# Altium schematic sheet PPU2 And Connector.SchDoc: SNES TST
size A4; DrawnBy: Opatus; DocumentNumber: 2; Revision: 0; SheetNumber: 2; SheetTotal: 4
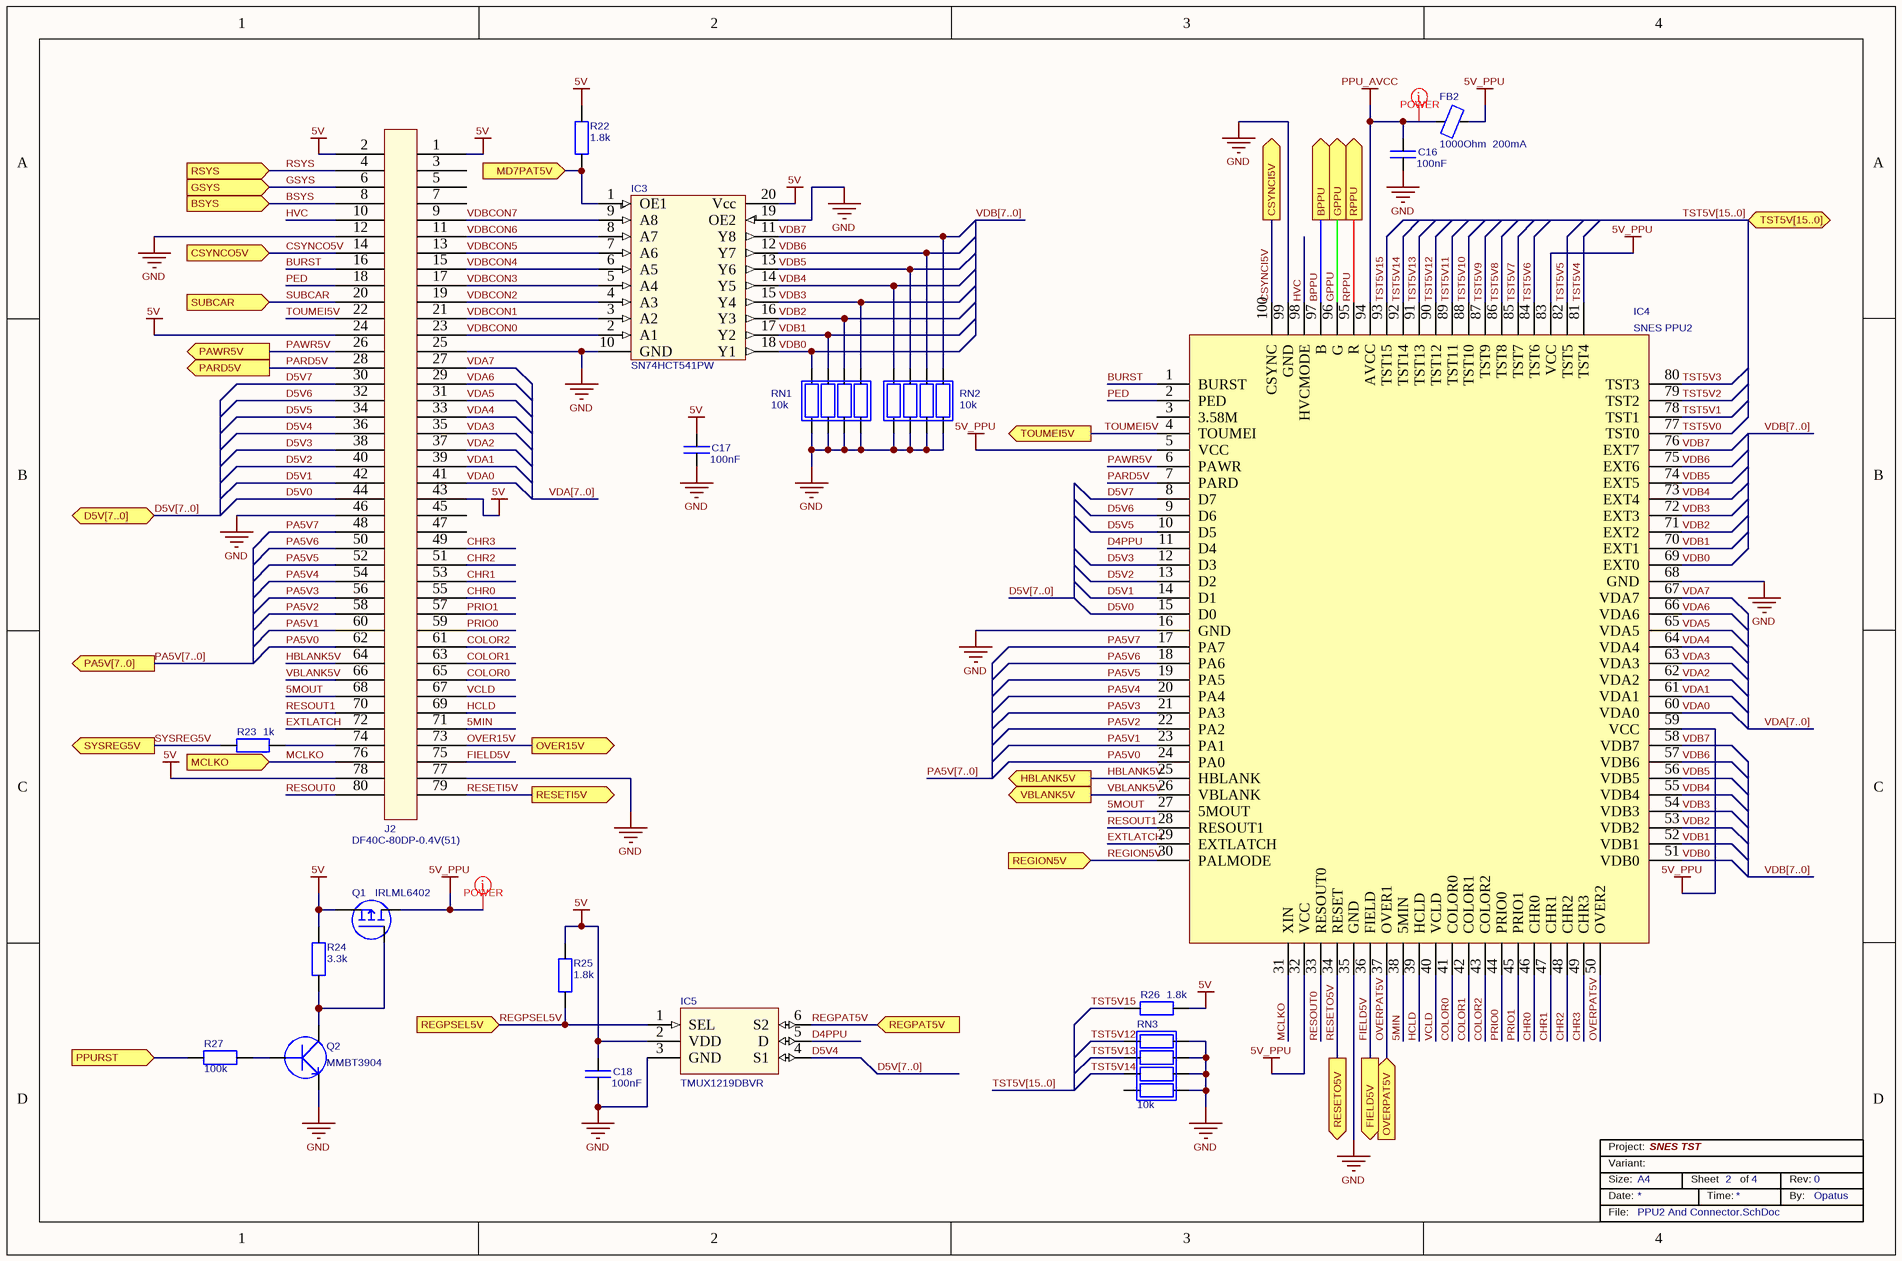
[diagram p0: PPU2 And Connector.SchDoc]

## Parts
C16  value 100nF  [Cap_0402_Chip]  (hidden comment: Ceramic Capacitor 100nF 10V ±20% X7R 0402)
C17  value 100nF  [Cap_0402_Chip]  (hidden comment: Ceramic Capacitor 100nF 10V ±20% X7R 0402)
C18  value 100nF  [Cap_0402_Chip]  (hidden comment: Ceramic Capacitor 100nF 10V ±20% X7R 0402)
FB2  1000Ohm  200mA  [Ind_0402_Chip]
IC3  Manufacturer_Part_Number: SN74HCT541PW  [TSSOP20 Narrow]  (hidden comment: SN74HCT541)
IC4  SNES PPU2  [PPU100Pin]  (no BOM)
IC5  Manufacturer_Part_Number: TMUX1219DBVR  [SOT23-6]  (hidden comment: TMUX1219)
J2  Manufacturer_Part_Number: DF40C-80DP-0.4V(51)  [DF40C-80DP]  (hidden comment: DF40C-80DP)
Q1  IRLML6402  [SOT23_FET]
Q2  MMBT3904  [SOT23_Transistor]
R22  value 1.8k  [Res_0402_Chip]  (hidden comment: Resistor 1.8k 0402 ±1%)
R23  value 1k  [Res_0402_Chip]  (hidden comment: Resistor 1k 0402 ±1%)
R24  value 3.3k  [Res_0402_Chip]  (hidden comment: Resistor 3.3k 0402 ±1%)
R25  value 1.8k  [Res_0402_Chip]  (hidden comment: Resistor 1.8k 0402 ±1%)
R26  value 1.8k  [Res_0402_Chip]  (hidden comment: Resistor 1.8k 0402 ±1%)
R27  value 100k  [Res_0402_Chip]  (hidden comment: Resistor 100k 0402 ±1%)
RN1  value 10k  [1206_Array_Chip]  (hidden comment: Resistor Network 10k 1206 ±1%)
RN2  value 10k  [1206_Array_Chip]  (hidden comment: Resistor Network 10k 1206 ±1%)
RN3  value 10k  [1206_Array_Chip]  (hidden comment: Resistor Network 10k 1206 ±1%)

## Ports
BPPU (out), BSYS (in), CSYNCI5V (out), CSYNCO5V (in), D5V[7..0] (bidir), FIELD5V (out), GPPU (out), GSYS (in), HBLANK5V (out), MCLKO (in), MD7PAT5V (in), OVER15V (out), OVERPAT5V (in), PA5V[7..0] (out), PARD5V (out), PAWR5V (out), PPURST (in), REGION5V (in), REGPAT5V (in), REGPSEL5V (in), RESETI5V (out), RESETO5V (out), RPPU (out), RSYS (in), SUBCAR (in), SYSREG5V (out), TOUMEI5V (out), TST5V[15..0] (bidir), VBLANK5V (out)

## Nets
5V: C17.1 C18.1 IC3.20(Vcc) IC5.2(VDD) J2.1 J2.2 J2.24 J2.43 J2.78 Q1.S R22.1 R24.1 R25.1 R26.1
5V_PPU: FB2.1 IC4.5(VCC) IC4.32(VCC) IC4.59(VCC) IC4.83(VCC) Q1.D
GND: C16.2 C17.2 C18.2 IC3.10(GND) IC3.19(OE2) IC4.16(GND) IC4.35(GND) IC4.68(GND) IC4.99(GND) IC5.3(GND) J2.12 J2.25 J2.46 J2.77 Q2.E RN1.1 RN1.2 RN1.3 RN1.4 RN2.1 RN2.2 RN2.3 RN2.4 RN3.1 RN3.2 RN3.3 RN3.4
PPU_AVCC: C16.1 FB2.2 IC4.94(AVCC)
5MIN: IC4.38(5MIN) J2.71
5MOUT: IC4.27(5MOUT) J2.68
BPPU: IC4.97(B) ; port BPPU
BSYS: J2.8 ; port BSYS
BURST: IC4.1(BURST) J2.16
CHR0: IC4.46(CHR0) J2.55
CHR1: IC4.47(CHR1) J2.53
CHR2: IC4.48(CHR2) J2.51
CHR3: IC4.49(CHR3) J2.49
COLOR0: IC4.41(COLOR0) J2.65
COLOR1: IC4.42(COLOR1) J2.63
COLOR2: IC4.43(COLOR2) J2.61
CSYNCI5V: IC4.100(CSYNC) ; port CSYNCI5V
CSYNCO5V: J2.14 ; port CSYNCO5V
D4PPU: IC4.11(D4) IC5.5(D)
D5V0: IC4.15(D0) J2.44
D5V1: IC4.14(D1) J2.42
D5V2: IC4.13(D2) J2.40
D5V3: IC4.12(D3) J2.38
D5V4: IC5.4(S1) J2.36
D5V5: IC4.10(D5) J2.34
D5V6: IC4.9(D6) J2.32
D5V7: IC4.8(D7) J2.30
EXTLATCH: IC4.29(EXTLATCH) J2.72
FIELD5V: IC4.36(FIELD) J2.75 ; port FIELD5V
GPPU: IC4.96(G) ; port GPPU
GSYS: J2.6 ; port GSYS
HBLANK5V: IC4.25(HBLANK) J2.64 ; port HBLANK5V
HCLD: IC4.39(HCLD) J2.69
HVC: IC4.98(HVCMODE) J2.10
MCLKO: IC4.31(XIN) J2.76 ; port MCLKO
MD7PAT5V: IC3.1(OE1) R22.2 ; port MD7PAT5V
OVER15V: J2.73 ; port OVER15V
OVERPAT5V: IC4.37(OVER1) IC4.50(OVER2) ; port OVERPAT5V
PA5V0: IC4.24(PA0) J2.62
PA5V1: IC4.23(PA1) J2.60
PA5V2: IC4.22(PA2) J2.58
PA5V3: IC4.21(PA3) J2.56
PA5V4: IC4.20(PA4) J2.54
PA5V5: IC4.19(PA5) J2.52
PA5V6: IC4.18(PA6) J2.50
PA5V7: IC4.17(PA7) J2.48
PARD5V: IC4.7(PARD) J2.28 ; port PARD5V
PAWR5V: IC4.6(PAWR) J2.26 ; port PAWR5V
PED: IC4.2(PED) J2.18
PPURST: R27.1 ; port PPURST
PRIO0: IC4.44(PRIO0) J2.59
PRIO1: IC4.45(PRIO1) J2.57
REGION5V: IC4.30(PALMODE) ; port REGION5V
REGPAT5V: IC5.6(S2) ; port REGPAT5V
REGPSEL5V: IC5.1(SEL) R25.2 ; port REGPSEL5V
RESETI5V: J2.79 ; port RESETI5V
RESETO5V: IC4.34(RESET) ; port RESETO5V
RESOUT0: IC4.33(RESOUT0) J2.80
RESOUT1: IC4.28(RESOUT1) J2.70
RPPU: IC4.95(R) ; port RPPU
RSYS: J2.4 ; port RSYS
SUBCAR: J2.20 ; port SUBCAR
SYSREG5V: R23.1 ; port SYSREG5V
TOUMEI5V: IC4.4(TOUMEI) J2.22 ; port TOUMEI5V
TST5V0: IC4.77(TST0)
TST5V1: IC4.78(TST1)
TST5V2: IC4.79(TST2)
TST5V3: IC4.80(TST3)
TST5V4: IC4.81(TST4)
TST5V5: IC4.82(TST5)
TST5V6: IC4.84(TST6)
TST5V7: IC4.85(TST7)
TST5V8: IC4.86(TST8)
TST5V9: IC4.87(TST9)
TST5V10: IC4.88(TST10)
TST5V11: IC4.89(TST11)
TST5V12: IC4.90(TST12) RN3.5
TST5V13: IC4.91(TST13) RN3.6
TST5V14: IC4.92(TST14) RN3.7
TST5V15: IC4.93(TST15) R26.2
VBLANK5V: IC4.26(VBLANK) J2.66 ; port VBLANK5V
VCLD: IC4.40(VCLD) J2.67
VDA0: IC4.60(VDA0) J2.41
VDA1: IC4.61(VDA1) J2.39
VDA2: IC4.62(VDA2) J2.37
VDA3: IC4.63(VDA3) J2.35
VDA4: IC4.64(VDA4) J2.33
VDA5: IC4.65(VDA5) J2.31
VDA6: IC4.66(VDA6) J2.29
VDA7: IC4.67(VDA7) J2.27
VDB0: IC3.18(Y1) IC4.51(VDB0) IC4.69(EXT0) RN1.8
VDB1: IC3.17(Y2) IC4.52(VDB1) IC4.70(EXT1) RN1.7
VDB2: IC3.16(Y3) IC4.53(VDB2) IC4.71(EXT2) RN1.6
VDB3: IC3.15(Y4) IC4.54(VDB3) IC4.72(EXT3) RN1.5
VDB4: IC3.14(Y5) IC4.55(VDB4) IC4.73(EXT4) RN2.8
VDB5: IC3.13(Y6) IC4.56(VDB5) IC4.74(EXT5) RN2.7
VDB6: IC3.12(Y7) IC4.57(VDB6) IC4.75(EXT6) RN2.6
VDB7: IC3.11(Y8) IC4.58(VDB7) IC4.76(EXT7) RN2.5
VDBCON0: IC3.2(A1) J2.23
VDBCON1: IC3.3(A2) J2.21
VDBCON2: IC3.4(A3) J2.19
VDBCON3: IC3.5(A4) J2.17
VDBCON4: IC3.6(A5) J2.15
VDBCON5: IC3.7(A6) J2.13
VDBCON6: IC3.8(A7) J2.11
VDBCON7: IC3.9(A8) J2.9
NetJ2_74: J2.74 R23.2
NetQ1_G: Q1.G Q2.C R24.2
NetQ2_B: Q2.B R27.2

Not connected (* = marked no-connect by the designer): IC4 3(3.58M); J2 3 5 7 45 47; RN3 8

## Buses and harness runs
bus D5V[7..0]
bus D5V[7..0] = port D5V[7..0]
bus PA5V[7..0]
bus PA5V[7..0] = port PA5V[7..0]
bus TST5V[15..0]
bus TST5V[15..0] = port TST5V[15..0]
bus VDA[7..0]
bus VDB[7..0]

## Layout directives
net class POWER: 5V_PPU, PPU_AVCC

## Notes on the sheet
- Size:
- Date:
- Variant:
- Project:
- A4
- Sheet
- Time:
- of
- Rev:
- By:
- File:

## Library data of the parts
C16-C18 = Capacitor: ChipSize: 0402; NominalVoltage: 10V; Dielectric: X7R; Tolerance: ±20%; PartType: Ceramic Capacitor
FB2 = Ferrite Bead: Manufacturer_Part_Number: MMZ1005S102CT000; Vendor: TDK; Value: 1000Ohm  200mA
IC3 = SN74HCT541: Vendor: Texas Instruments
IC4 = PPU2100Pin: PPU2; Vendor: Nintendo; Manufacturer_Part_Number: PPU2
IC5 = TMUX1219: 2:1 MUX; Vendor: Texas Instruments
J2 = Conn 80P: 80Pole Connector; Vendor: Hirose Connector
Q1 = Mosfet1: Vendor: Diodes; Manufacturer_Part_Number: IRLML6402
Q2 = T_NPN: Vendor: Diodes; Manufacturer_Part_Number: MMBT3904
R22-R27 = R: ChipSize: 0402; Tolerance: ±1%; PartType: Resistor
RN1-RN3 = RNetwork: ChipSize: 1206; Tolerance: ±1%; PartType: Resistor Network